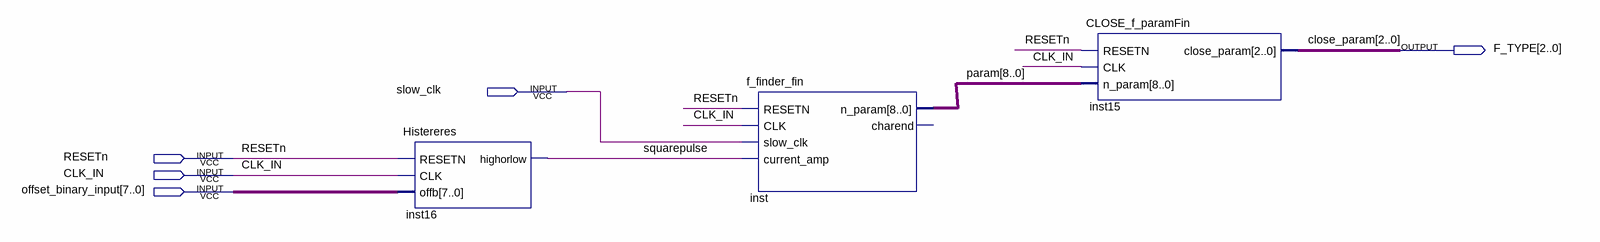
[diagram p0: schematic sheet]
// Quartus schematic SIN2FREQ.bdf as structural Verilog: 3 symbols, 5 pins
module SIN2FREQ (
  input  slow_clk,
  input  RESETn,
  input  CLK_IN,
  input  [7:0] offset_binary_input,
  output [2:0] F_TYPE
);

  wire squarepulse;
  wire [8:0] param;

  Histereres inst16 (.RESETN(RESETn), .CLK(CLK_IN), .offb(offset_binary_input), .highorlow(squarepulse));
  f_finder_fin inst (
    .RESETN(RESETn), .CLK(CLK_IN), .slow_clk(slow_clk), .current_amp(squarepulse), .n_param(param));  // open: charend
  CLOSE_f_paramFin inst15 (.RESETN(RESETn), .CLK(CLK_IN), .n_param(param), .close_param(F_TYPE));

  // Other names for the same wires on the sheet: close_param[2:0] = F_TYPE
endmodule
